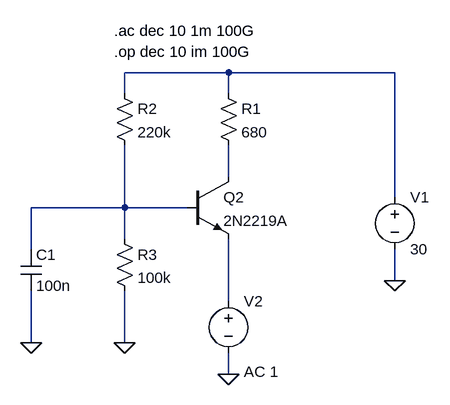
[diagram p0: schematic Half Circuit.asc]
Half Circuit.asc, the LTspice schematic file:
Version 4
SHEET 1 880 680
WIRE 384 -128 224 -128
WIRE 640 -128 384 -128
WIRE 224 -96 224 -128
WIRE 384 -96 384 -128
WIRE 384 32 384 -16
WIRE 640 64 640 -128
WIRE 224 80 224 -16
WIRE 224 80 80 80
WIRE 320 80 224 80
WIRE 224 128 224 80
WIRE 80 144 80 80
WIRE 640 192 640 144
WIRE 384 224 384 128
WIRE 80 288 80 208
WIRE 224 288 224 208
WIRE 384 336 384 304
FLAG 80 288 0
FLAG 224 288 0
FLAG 384 336 0
FLAG 640 192 0
SYMBOL cap 64 144 R0
SYMATTR InstName C1
SYMATTR Value 100n
SYMBOL res 208 -112 R0
SYMATTR InstName R2
SYMATTR Value 220k
SYMBOL res 208 112 R0
SYMATTR InstName R3
SYMATTR Value 100k
SYMBOL voltage 640 48 R0
WINDOW 123 0 0 Left 0
WINDOW 39 0 0 Left 0
SYMATTR InstName V1
SYMATTR Value 30
SYMBOL npn 320 32 R0
SYMATTR InstName Q2
SYMATTR Value 2N2219A
SYMBOL res 368 -112 R0
SYMATTR InstName R1
SYMATTR Value 680
SYMBOL voltage 384 208 R0
WINDOW 123 24 124 Left 2
WINDOW 39 0 0 Left 0
SYMATTR InstName V2
SYMATTR Value ""
SYMATTR Value2 AC 1
TEXT 208 -192 Left 2 !.ac dec 10 1m 100G
TEXT 208 -160 Left 2 !.op dec 10 im 100G

The netlist it stands for:
* Half Circuit.asc
C1 N003 0 100n
R2 N001 N003 220k
R3 N003 0 100k
V1 N001 0 30
Q2 N002 N003 N004 0 2N2219A
R1 N001 N002 680
V2 N004 0 AC 1
.model NPN NPN
.model PNP PNP
.lib standard.bjt
.ac dec 10 1m 100G
.op dec 10 im 100G
.backanno
.end